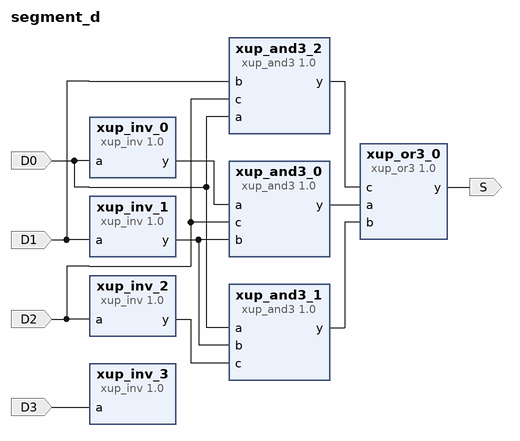
[diagram p0: block diagram of the top level]
# Vivado block design segment_d, xc7a100tcsg324-1, Vivado 2019.2
create_bd_design segment_d

create_bd_port -dir I D1
create_bd_port -dir I D0
create_bd_port -dir I D3
create_bd_port -dir I D2
create_bd_port -dir O S

create_bd_cell -type ip -vlnv xilinx.com:xup:xup_and3:1.0 xup_and3_0
create_bd_cell -type ip -vlnv xilinx.com:xup:xup_and3:1.0 xup_and3_1
create_bd_cell -type ip -vlnv xilinx.com:xup:xup_and3:1.0 xup_and3_2
create_bd_cell -type ip -vlnv xilinx.com:xup:xup_or3:1.0 xup_or3_0
create_bd_cell -type ip -vlnv xilinx.com:xup:xup_inv:1.0 xup_inv_0
create_bd_cell -type ip -vlnv xilinx.com:xup:xup_inv:1.0 xup_inv_1
create_bd_cell -type ip -vlnv xilinx.com:xup:xup_inv:1.0 xup_inv_2
create_bd_cell -type ip -vlnv xilinx.com:xup:xup_inv:1.0 xup_inv_3

# ---- connections ----

connect_bd_net [get_bd_pins xup_and3_0/y] [get_bd_pins xup_or3_0/a]
connect_bd_net [get_bd_pins xup_and3_1/y] [get_bd_pins xup_or3_0/b]
connect_bd_net [get_bd_pins xup_and3_2/y] [get_bd_pins xup_or3_0/c]
connect_bd_net -net a_0_1 [get_bd_ports D1] [get_bd_pins xup_inv_1/a] [get_bd_pins xup_and3_2/b]
connect_bd_net -net a_1_1 [get_bd_ports D0] [get_bd_pins xup_inv_0/a] [get_bd_pins xup_and3_1/a] [get_bd_pins xup_and3_2/a]
connect_bd_net -net a_2_1 [get_bd_ports D3] [get_bd_pins xup_inv_3/a]
connect_bd_net -net a_3_1 [get_bd_ports D2] [get_bd_pins xup_inv_2/a] [get_bd_pins xup_and3_0/c] [get_bd_pins xup_and3_2/c]
connect_bd_net [get_bd_pins xup_or3_0/y] [get_bd_ports S]
connect_bd_net [get_bd_pins xup_inv_1/y] [get_bd_pins xup_and3_0/b] [get_bd_pins xup_and3_1/b]
connect_bd_net [get_bd_pins xup_inv_0/y] [get_bd_pins xup_and3_0/a]
connect_bd_net [get_bd_pins xup_inv_2/y] [get_bd_pins xup_and3_1/c]

validate_bd_design
save_bd_design
